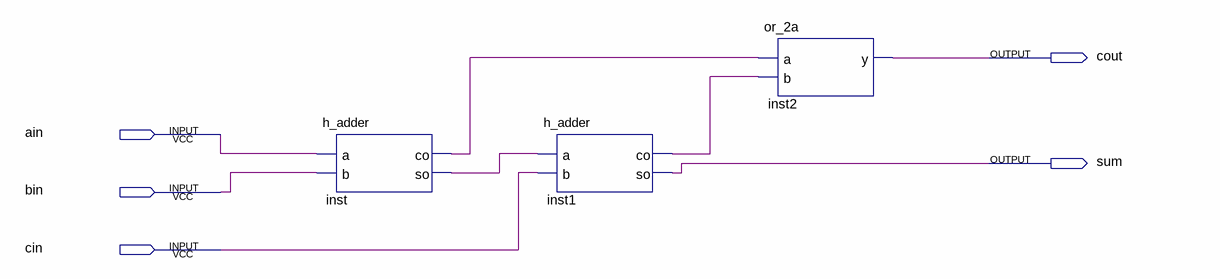
[diagram p0: schematic sheet]
// Quartus schematic f_adder.bdf as structural Verilog: 3 symbols, 5 pins
module f_adder (
  input  ain,
  input  bin,
  input  cin,
  output cout,
  output sum
);

  wire inst1_co, inst_co, inst_so;

  h_adder inst (.a(ain), .b(bin), .co(inst_co), .so(inst_so));
  h_adder inst1 (.a(inst_so), .b(cin), .co(inst1_co), .so(sum));
  or_2a inst2 (.a(inst_co), .b(inst1_co), .y(cout));
endmodule
